# EAGLE design mag_encoder (EAGLE 6.6.0)
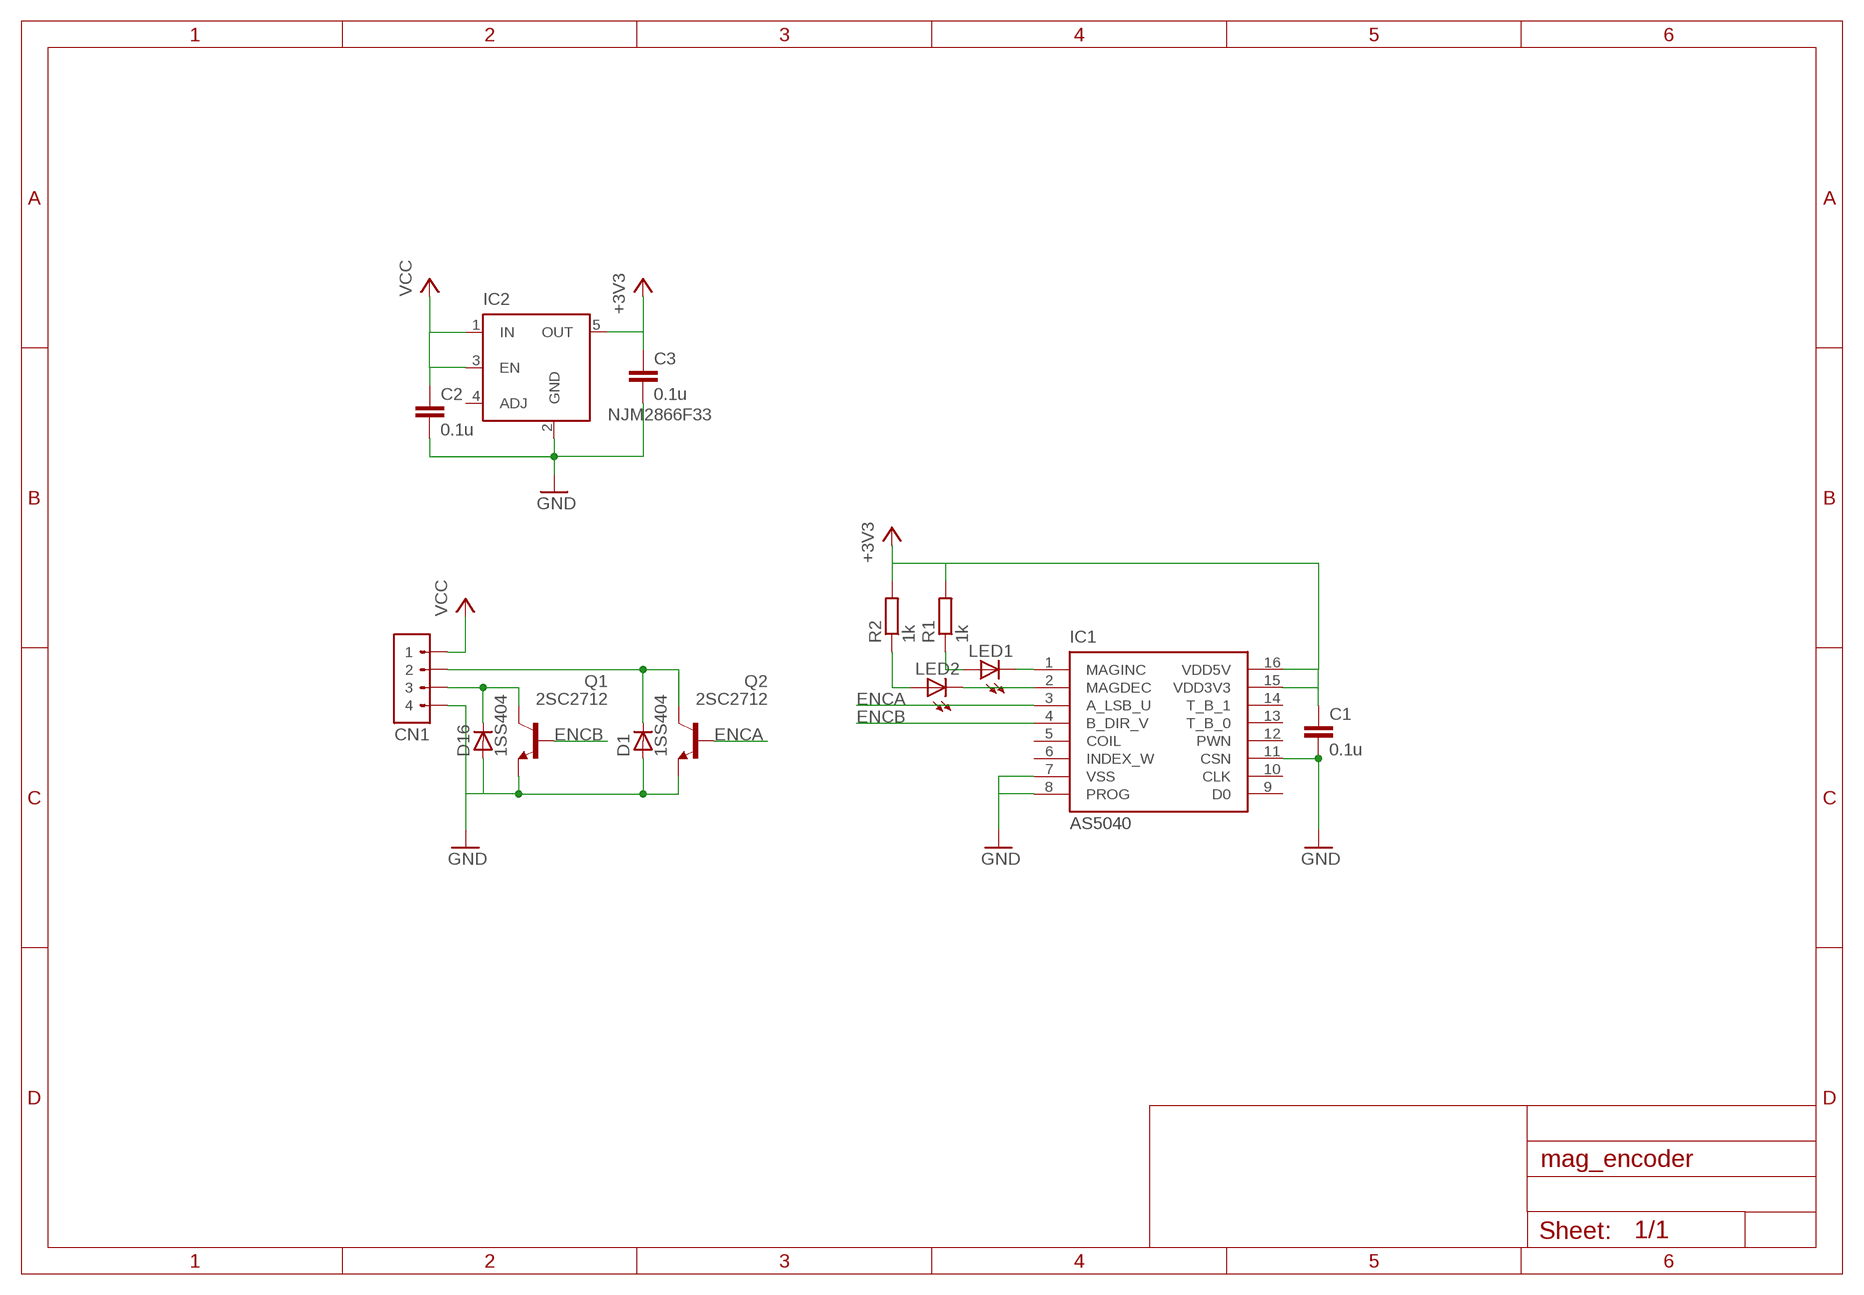
[diagram p0: schematic, sheet 1]

## Parts
C1  0.1u  C-EUC0603K  [C0603K]
C2  0.1u  C-EUC0603K  [C0603K]
C3  0.1u  C-EUC0603K  [C0603K]
CN1  CN4-JST-XH-TOP  [JST-B4B-XH-A]
D1  1SS404  [USC(1.25X2.5)]
D16  1SS404  [USC(1.25X2.5)]
IC1  AS5040  [SSOP16]
IC2  NJM2866F33  MIC5219BM5  [SOT23-5]
LED1  LEDSML0603  [SML0603]
LED2  LEDSML0603  [SML0603]
Q1  2SC2712  [SC-59(TYPE1)]
Q2  2SC2712  [SC-59(TYPE1)]
R1  1k  R-EU_R0603  [R0603]
R2  1k  R-EU_R0603  [R0603]

## Nets
+3V3: C1.1 C3.1 IC1.15(VDD3V3) IC1.16(VDD5V) IC2.5(OUT) R1.2 R2.2
ENCA: IC1.3(A_LSB_U) Q2.B
ENCB: IC1.4(B_DIR_V) Q1.B
GND: C1.2 C2.2 C3.2 CN1.4 D1.A D16.A IC1.7(VSS) IC1.8(PROG) IC1.11(CSN) IC2.2(GND) Q1.E Q2.E
N$1: CN1.3 D16.K(C) Q1.C
N$2: LED1.A R1.1
N$3: LED2.A R2.1
N$4: IC1.1(MAGINC) LED1.C
N$5: IC1.2(MAGDEC) LED2.C
N$6: CN1.2 D1.K(C) Q2.C
VCC: C2.1 CN1.1 IC2.1(IN) IC2.3(EN)
Unconnected: IC1.5(COIL) IC1.6(INDEX_W) IC1.9(D0) IC1.10(CLK) IC1.12(PWN) IC1.13(T_B_0) IC1.14(T_B_1) IC2.4(ADJ)

## Library data of the parts
C1-C3 = resistor:C-EU: CAPACITOR, European symbol
CN1 = con-jst_xh:CN4: Connector 4 circuits
D1 D16 = diode:1SS404
IC1 = austriamicrosystems:AS5040: 10-BIT PROGRAMMABLE MAGNETIC ROTARY ENCODER Source: www.austriamicrosystems.com .. AS5040DataSheetRev12.pdf
IC2 = v-reg-micrel:MIC5219BM5: VOLTAGE REGULATOR; MF: ALTERA CORPORATION; MPN: MIC5219BM5 TR; OC_FARNELL: 1100656; OC_NEWARK: 09J8939
LED1 LED2 = led:LED: LED OSRAM: - CHIPLED LG R971, LG N971, LY N971, LG Q971, LY Q971, LO R971, LY R971 LH N974, LH R974 LS Q976, LO Q976, LY Q976 LO Q996 - Hyper CHIPLED LW Q18S LB Q993, LB Q99A, LB R99A - SideLED LS A670, LO A670, LY A670, LG A670, LP A670 LB A673, LV A673, LT A673, LW A673 LH A674 LY A675 LS A676, LA A676, LO A676, LY A676, LW A676 LS A679, LY A679, LG A679 - Hyper Micro SIDELED® LS Y876, LA Y876, LO Y876, LY Y876 LT Y87S - SmartLED LW L88C, LW L88S LB L89C, LB L89S, LG L890 LS L89K, LO L89K, LY L89K LS L896, LA L896, LO L896, LY L896 - TOPLED LS T670, LO T670, LY T670, LG T670, LP T670 LSG T670, LSP T670, LSY T670, LOP T670, LYG T670 LG T671, LOG T671, LSG T671 LB T673, LV T673, LT T673, LW T673 LH T674 LS T676, LA T676, LO T676, LY T676, LB T676, LH T676, LSB T676, LW T676 LB T67C, LV T67C, LT T67C, LS T67K, LO T67K, LY T67K, LW E67C LS E67B, LA E67B, LO E67B, LY E67B, LB E67C, LV E67C, LT E67C LW T67C LS T679, LY T679, LG T679 LS T770, LO T770, LY T770, LG T770, LP T770 LB T773, LV T773, LT T773, LW T773 LH T774 LS E675, LA E675, LY E675, LS T675 LS T776, LA T776, LO T776, LY T776, LB T776 LHGB T686 LT T68C, LB T68C - Hyper Mini TOPLED® LB M676 - Mini TOPLED Santana® LG M470 LS M47K, LO M47K, LY M47K Source: http://www.osram.convergy.de LUXEON: - LUMILED® LXK2-PW12-R00, LXK2-PW12-S00, LXK2-PW14-U00, LXK2-PW14-V00 LXK2-PM12-R00, LXK2-PM12-S00, LXK2-PM14-U00 LXK2-PE12-Q00, LXK2-PE12-R00, LXK2-PE12-S00, LXK2-PE14-T00, LXK2-PE14-U00 LXK2-PB12-K00, LXK2-PB12-L00, LXK2-PB12-M00, LXK2-PB14-N00, LXK2-PB14-P00, LXK2-PB14-Q00 LXK2-PR12-L00, LXK2-PR12-M00, LXK2-PR14-Q00, LXK2-PR14-R00 LXK2-PD12-Q00, LXK2-PD12-R00, LXK2-PD12-S00 LXK2-PH12-R00, LXK2-PH12-S00 LXK2-PL12-P00, LXK2-PL12-Q00, LXK2-PL12-R00 Source: www.luxeon.com KINGBRIGHT: KA-3528ASYC Source: www.kingbright.com
Q1 Q2 = Transistor:2SC2712
R1 R2 = resistor:R-EU_: RESISTOR, European symbol

## Board
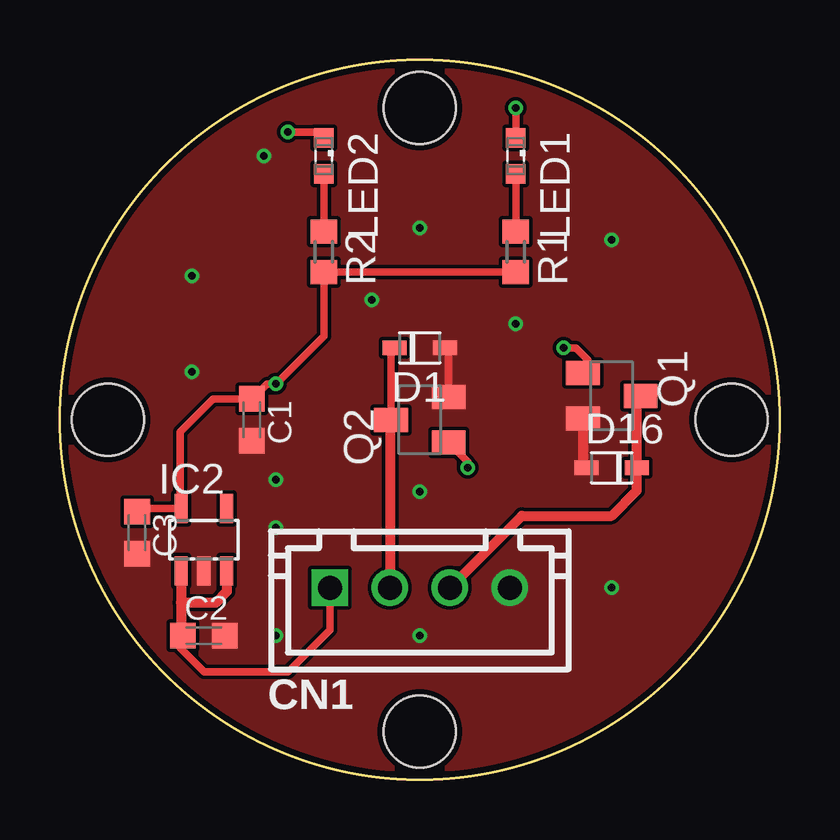
[diagram p1: board, top side]
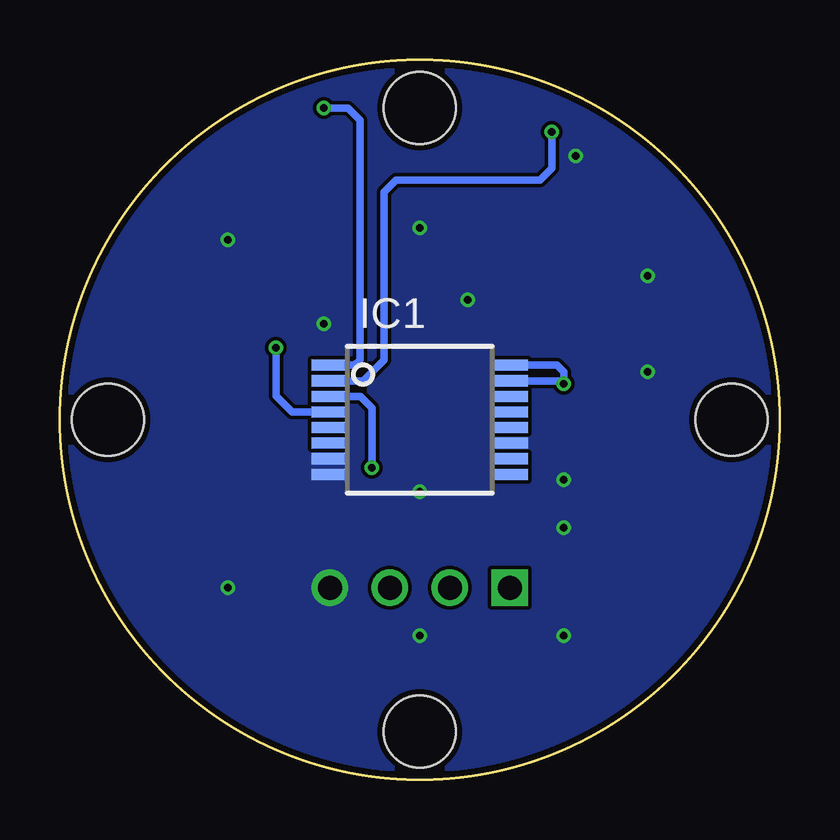
[diagram p2: board, bottom side, seen from below]

Size 30 x 30 mm. Coordinates in mm from the lower left corner, seen from the top.
Outline: circle at 15,15 radius 15
Copper layers (1*16): Top 0.035mm / dielectric 1.5mm / Bottom 0.035mm
Design rules "Elecrow_2-layer_eagle_rule": minimum track width 6mil, minimum drill 12mil, track to track 6mil, track to pad 6mil, pad to pad 6mil, via to via 6mil, smd to smd 0mil, copper to edge 10mil, drill to drill 10mil, minimum pad ring 10mil, minimum via ring 6mil, stop-mask expansion 2mil, vias tented up to drill 100mil, thermal gap 10mil
Holes 3 mm at 2,15 15,28 28,15 15,2

### Footprints (pad centres in the part's own frame; a part is rotated, then mirrored left to right if it is on the bottom)
C0603K = smd 1.05 x 1.08: 1 -0.875,0; 2 0.875,0
JST-B4B-XH-A = drill 1 square: 1 -3.75,0 | drill 1: 2 -1.25,0; 3 1.25,0; 4 3.75,0
USC(1.25X2.5) = smd 1 x 0.6: A -1.05,0; K 1.05,0
SSOP16 = smd 0.46 x 1.43: 1 -2.275,-3.795; 2 -1.625,-3.795; 3 -0.975,-3.795; 4 -0.325,-3.795; 5 0.325,-3.795; 6 0.975,-3.795; 7 1.625,-3.795; 8 2.275,-3.795; 9 2.275,3.795; 10 1.625,3.795; 11 0.975,3.795; 12 0.325,3.795; 13 -0.325,3.795; 14 -0.975,3.795; 15 -1.625,3.795; 16 -2.275,3.795
SOT23-5 = smd 0.55 x 1.2: 1 -0.95,-1.3; 2 0,-1.3; 3 0.95,-1.3; 4 0.95,1.3; 5 -0.95,1.3
SML0603 = smd 0.8 x 0.8: A 0.75,0; C -0.75,0
SC-59(TYPE1) = smd 1 x 1.4: B -0.95,-1.2; C 0,1.2; E 0.95,-1.2
R0603 = smd 1 x 1.1: 1 -0.85,0; 2 0.85,0

### Placement (x,y rotation side)
C1  8,15 270 top
C2  6,6 0 top
C3  3.21,10.29 270 top
CN1  15,8 0 top
D1  15,18 180 top
D16  23,13 0 top
IC1  15,15 270 bottom
IC2  6,10 0 top
LED1  19,26 270 top
LED2  11,26 270 top
Q1  23,16 270 top
Q2  15,15 90 top
R1  19,22 270 top
R2  11,22 270 top

### Tracks (layer width: path | path; a pad name or v marks a point on that pad's centre or on a via)
+3V3  (via drill 0.3)
  Top 0.305: C3.1 3.35,11.3 IC2.5 5,11.35 5,14.5 6.38,15.88 C1.1 8.62,16.5 v9,16.5 11,18.5 R2.2 R1.2
  Bottom 0.305: IC1.15 9.12,16.62 v9,16.5 9,17 9.28,17.27 IC1.16
ENCA  (via drill 0.3)
  Top 0.305: v17,13 17,13.25 Q2.B
  Bottom 0.305: IC1.3 17.48,15.97 17,15.5 v17,13
ENCB  (via drill 0.3)
  Top 0.305: v21,18 21.5,18 22,17.5 22,17.15 Q1.B
  Bottom 0.305: IC1.4 20.32,15.32 21,16 v21,18
GND  (via drill 0.3)
  Top 0.305: Q2.E 16.2,17.85 D1.A
  Top 0.406: Q1.E 21.8,13.15 D16.A
  other vias: 23,8 19,19 13,20 15,12 15,23 5.5,21 8.5,26 5.5,17 9,6 9,10.5 9,12.5 15,6 23,22.5
  pour Top (no thermals): 0,30 30,30 30,0 0,0
  pour Bottom (no thermals): 0,30 30,30 30,0 0,0
N$1
  Top 0.406: CN1.3 19.25,11 23,11 24.05,12.05 D16.K 24.05,15.85 Q1.C
N$2
  Top 0.305: LED1.A R1.1
N$3
  Top 0.305: LED2.A R2.1
N$4  (via drill 0.3)
  Top 0.305: v19,28 LED1.C
  Bottom 0.305: IC1.1 17.73,17.27 17.5,17.5 17.5,27.5 18,28 v19,28
N$5  (via drill 0.3)
  Top 0.305: 11.25,27 LED2.C 10.75,27 v9.5,27
  Bottom 0.305: IC1.2 17.38,16.62 16.5,17.5 16.5,24.5 16,25 10,25 9.5,25.5 v9.5,27
N$6
  Top 0.305: Q2.C 13.8,17.85 D1.K
  Top 0.406: Q2.C 13.75,15 CN1.2
VCC
  Top 0.305: CN1.1 11.25,6.25 9.5,4.5 6,4.5 5,5.5 5,5.88 C2.1
  Top 0.406: IC2.1 5.05,7.38 | 5.05,7.38 5.05,6 C2.1 | IC2.3 6.95,7.83 6.5,7.38 5.05,7.38